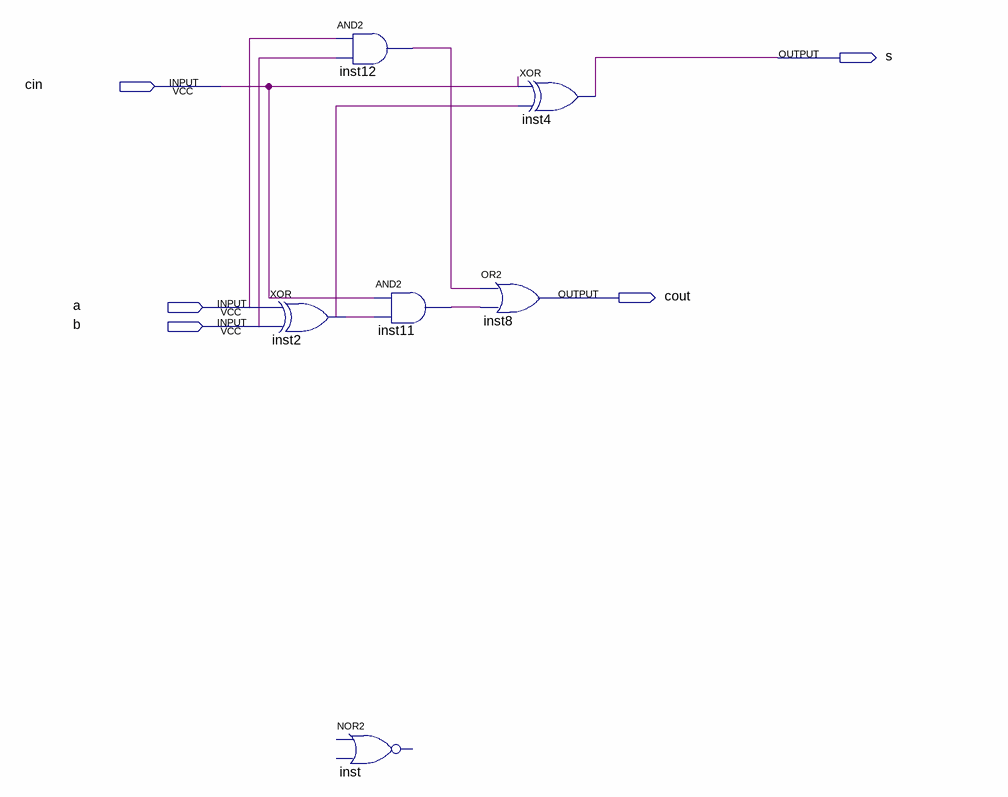
[diagram p0: schematic sheet]
// Quartus schematic sillifunction2.bdf as structural Verilog: 6 symbols, 5 pins
module sillifunction2 (
  input  cin,
  input  a,
  input  b,
  output s,
  output cout
);

  wire inst2_out, inst11_out, inst12_out, undriven, undriven_2, undriven_3;

  xor inst2 (inst2_out, a, b);
  and inst12 (inst12_out, undriven_2, undriven);
  and inst11 (inst11_out, cin, inst2_out);
  // NOR2 inst is placed but not wired
  xor inst4 (s, cin, undriven_3);
  or inst8 (cout, inst12_out, inst11_out);
endmodule
